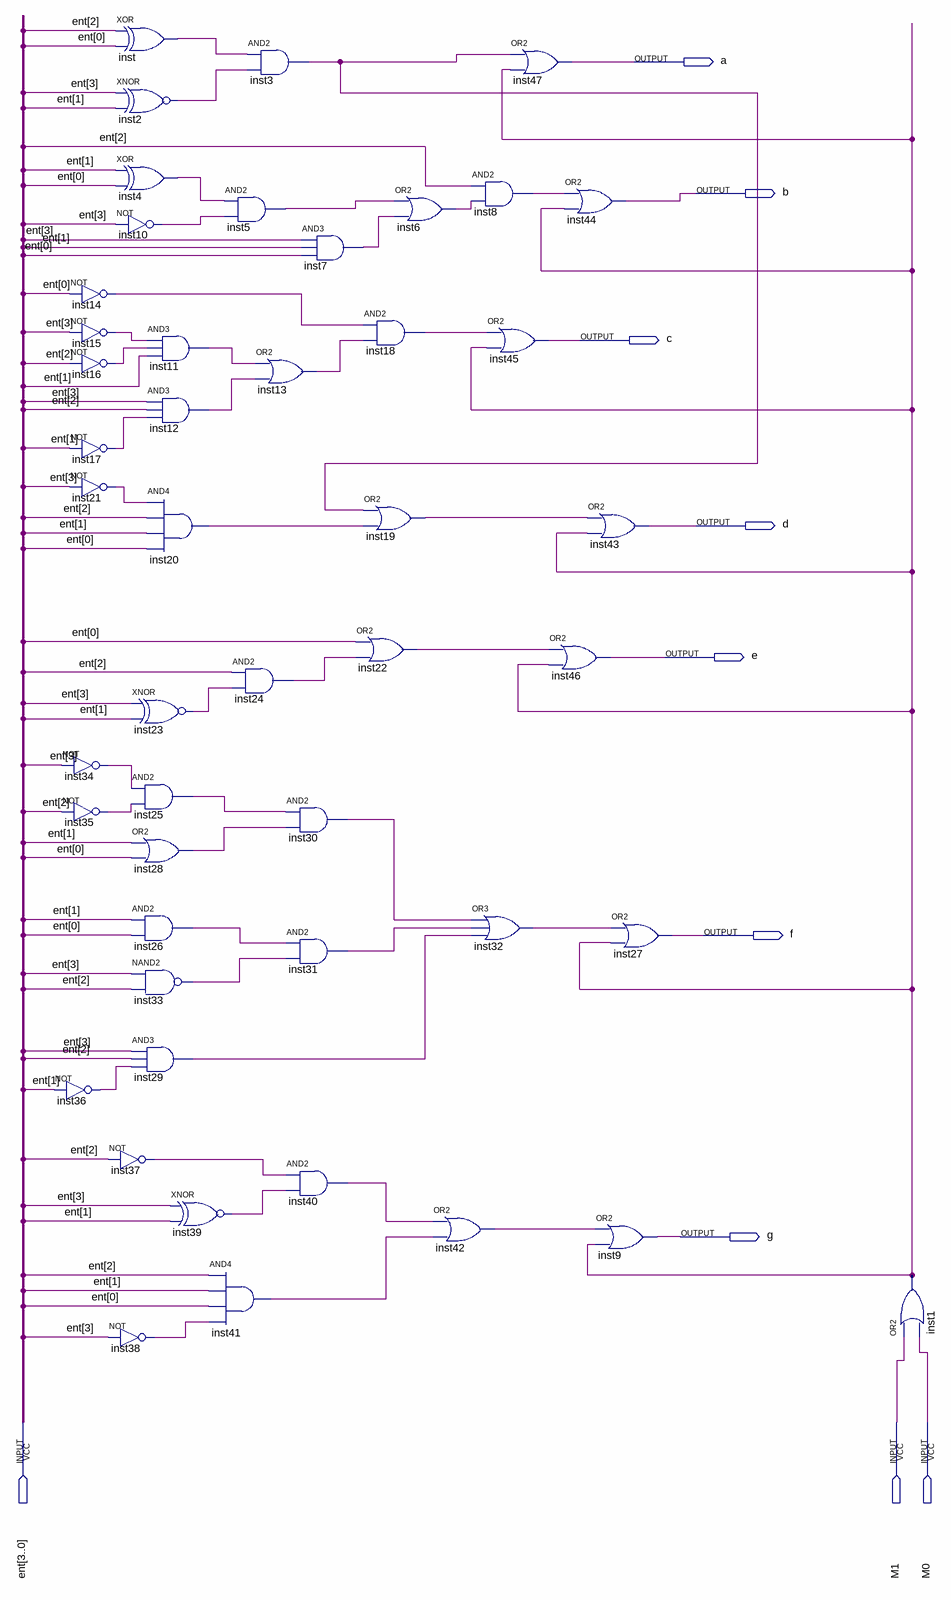
[diagram p0: schematic sheet]
// Quartus schematic DecodificadorEntrada-DisplayDireita.bdf as structural Verilog: 48 symbols, 10 pins
module \DecodificadorEntrada-DisplayDireita  (
  input  [3:0] ent,
  input  M1,
  input  M0,
  output a,
  output b,
  output c,
  output d,
  output e,
  output f,
  output g
);

  wire inst1_out, inst2_out, inst3_out, inst4_out, inst5_out, inst6_out, inst7_out, inst8_out, inst10_out,
       inst11_out, inst12_out, inst13_out, inst14_out, inst15_out, inst16_out, inst17_out, inst18_out,
       inst19_out, inst20_out, inst21_out, inst22_out, inst23_out, inst24_out, inst25_out, inst26_out,
       inst28_out, inst29_out, inst30_out, inst31_out, inst32_out, inst33_out, inst34_out, inst35_out,
       inst36_out, inst37_out, inst38_out, inst39_out, inst40_out, inst41_out, inst42_out, inst_out;

  not inst14 (inst14_out, ent[0]);
  not inst15 (inst15_out, ent[3]);
  not inst16 (inst16_out, ent[2]);
  not inst17 (inst17_out, ent[1]);
  not inst21 (inst21_out, ent[3]);
  not inst34 (inst34_out, ent[3]);
  not inst35 (inst35_out, ent[2]);
  not inst36 (inst36_out, ent[1]);
  xor inst (inst_out, ent[2], ent[0]);
  xnor inst2 (inst2_out, ent[3], ent[1]);
  xor inst4 (inst4_out, ent[1], ent[0]);
  not inst10 (inst10_out, ent[3]);
  and inst11 (inst11_out, inst15_out, inst16_out, ent[1]);
  and inst12 (inst12_out, ent[3], ent[2], inst17_out);
  and inst20 (inst20_out, inst21_out, ent[2], ent[1], ent[0]);
  xnor inst23 (inst23_out, ent[3], ent[1]);
  and inst25 (inst25_out, inst34_out, inst35_out);
  or inst28 (inst28_out, ent[1], ent[0]);
  and inst26 (inst26_out, ent[1], ent[0]);
  nand inst33 (inst33_out, ent[3], ent[2]);
  and inst29 (inst29_out, ent[3], ent[2], inst36_out);
  not inst37 (inst37_out, ent[2]);
  not inst38 (inst38_out, ent[3]);
  xnor inst39 (inst39_out, ent[3], ent[1]);
  and inst41 (inst41_out, ent[2], ent[1], ent[0], inst38_out);
  and inst3 (inst3_out, inst_out, inst2_out);
  and inst5 (inst5_out, inst4_out, inst10_out);
  or inst13 (inst13_out, inst11_out, inst12_out);
  and inst24 (inst24_out, ent[2], inst23_out);
  and inst7 (inst7_out, ent[3], ent[1], ent[0]);
  and inst30 (inst30_out, inst25_out, inst28_out);
  and inst31 (inst31_out, inst26_out, inst33_out);
  and inst40 (inst40_out, inst37_out, inst39_out);
  or inst6 (inst6_out, inst5_out, inst7_out);
  and inst18 (inst18_out, inst14_out, inst13_out);
  or inst19 (inst19_out, inst3_out, inst20_out);
  or inst22 (inst22_out, ent[0], inst24_out);
  or inst42 (inst42_out, inst40_out, inst41_out);
  or inst47 (a, inst3_out, inst1_out);
  and inst8 (inst8_out, ent[2], inst6_out);
  or inst45 (c, inst18_out, inst1_out);
  or inst32 (inst32_out, inst30_out, inst31_out, inst29_out);
  or inst44 (b, inst8_out, inst1_out);
  or inst43 (d, inst19_out, inst1_out);
  or inst46 (e, inst22_out, inst1_out);
  or inst27 (f, inst32_out, inst1_out);
  or inst9 (g, inst42_out, inst1_out);
  or inst1 (inst1_out, M1, M0);
endmodule
